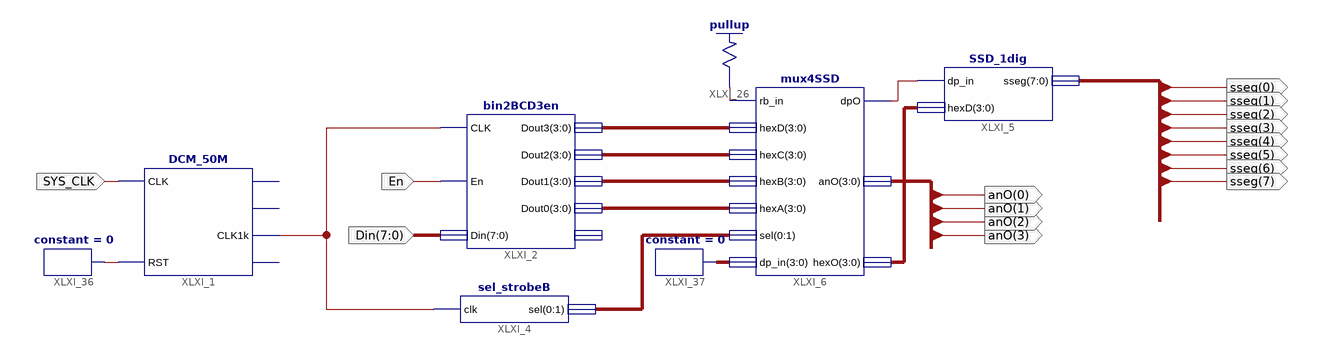
[diagram p0: schematic sheet 1]
// Xilinx ISE schematic Experiment3.sch (spartan3e) as structural Verilog: 8 symbols, 15 ports
module Experiment3 (
  input  En,
  input  [7:0] Din,
  input  SYS_CLK,
  output [3:0] anO,
  output [7:0] sseg
);

  wire XLXN_13, XLXN_180, XLXN_181, XLXN_220;
  wire [1:0] XLXN_239;
  wire [3:0] XLXN_185, XLXN_221, XLXN_222, XLXN_223, XLXN_224, XLXN_225;

  DCM_50M XLXI_1 (.CLK(SYS_CLK), .RST(XLXN_220), .CLK1k(XLXN_13));  // open: CLK1M, CLK10k, CLK1
  sel_strobeB XLXI_4 (.clk(XLXN_13), .sel({XLXN_239[0], XLXN_239[1]}));
  bin2BCD3en XLXI_2 (
    .CLK(XLXN_13), .En(En), .Din(Din), .Dout3(XLXN_222), .Dout2(XLXN_223), .Dout1(XLXN_224), .Dout0(XLXN_225));  // open: RBout
  mux4SSD XLXI_6 (
    .rb_in(XLXN_180), .hexD(XLXN_222), .hexC(XLXN_223), .hexB(XLXN_224), .hexA(XLXN_225),
    .sel({XLXN_239[0], XLXN_239[1]}), .dp_in(XLXN_221), .dpO(XLXN_181), .anO(anO), .hexO(XLXN_185));
  \pullup  XLXI_26 (.O(XLXN_180));
  SSD_1dig XLXI_5 (.dp_in(XLXN_181), .hexD(XLXN_185), .sseg(sseg));
  constant #(.CValue("0")) XLXI_36 (.O(XLXN_220));
  constant #(.CValue("0")) XLXI_37 (.O(XLXN_221));
endmodule
